# Altium schematic sheet FPGA_U1_Auto.SchDoc
size A0; Generated From FPGA Project: M2FS_FLS_Data_Formatter_8_14_2012.PrjFpg; UNUSED_SPECIAL: RouteSeparate; UNUSED_IO: NoERC; VREF: NoERC; UNUSED_INPUT: NoERC
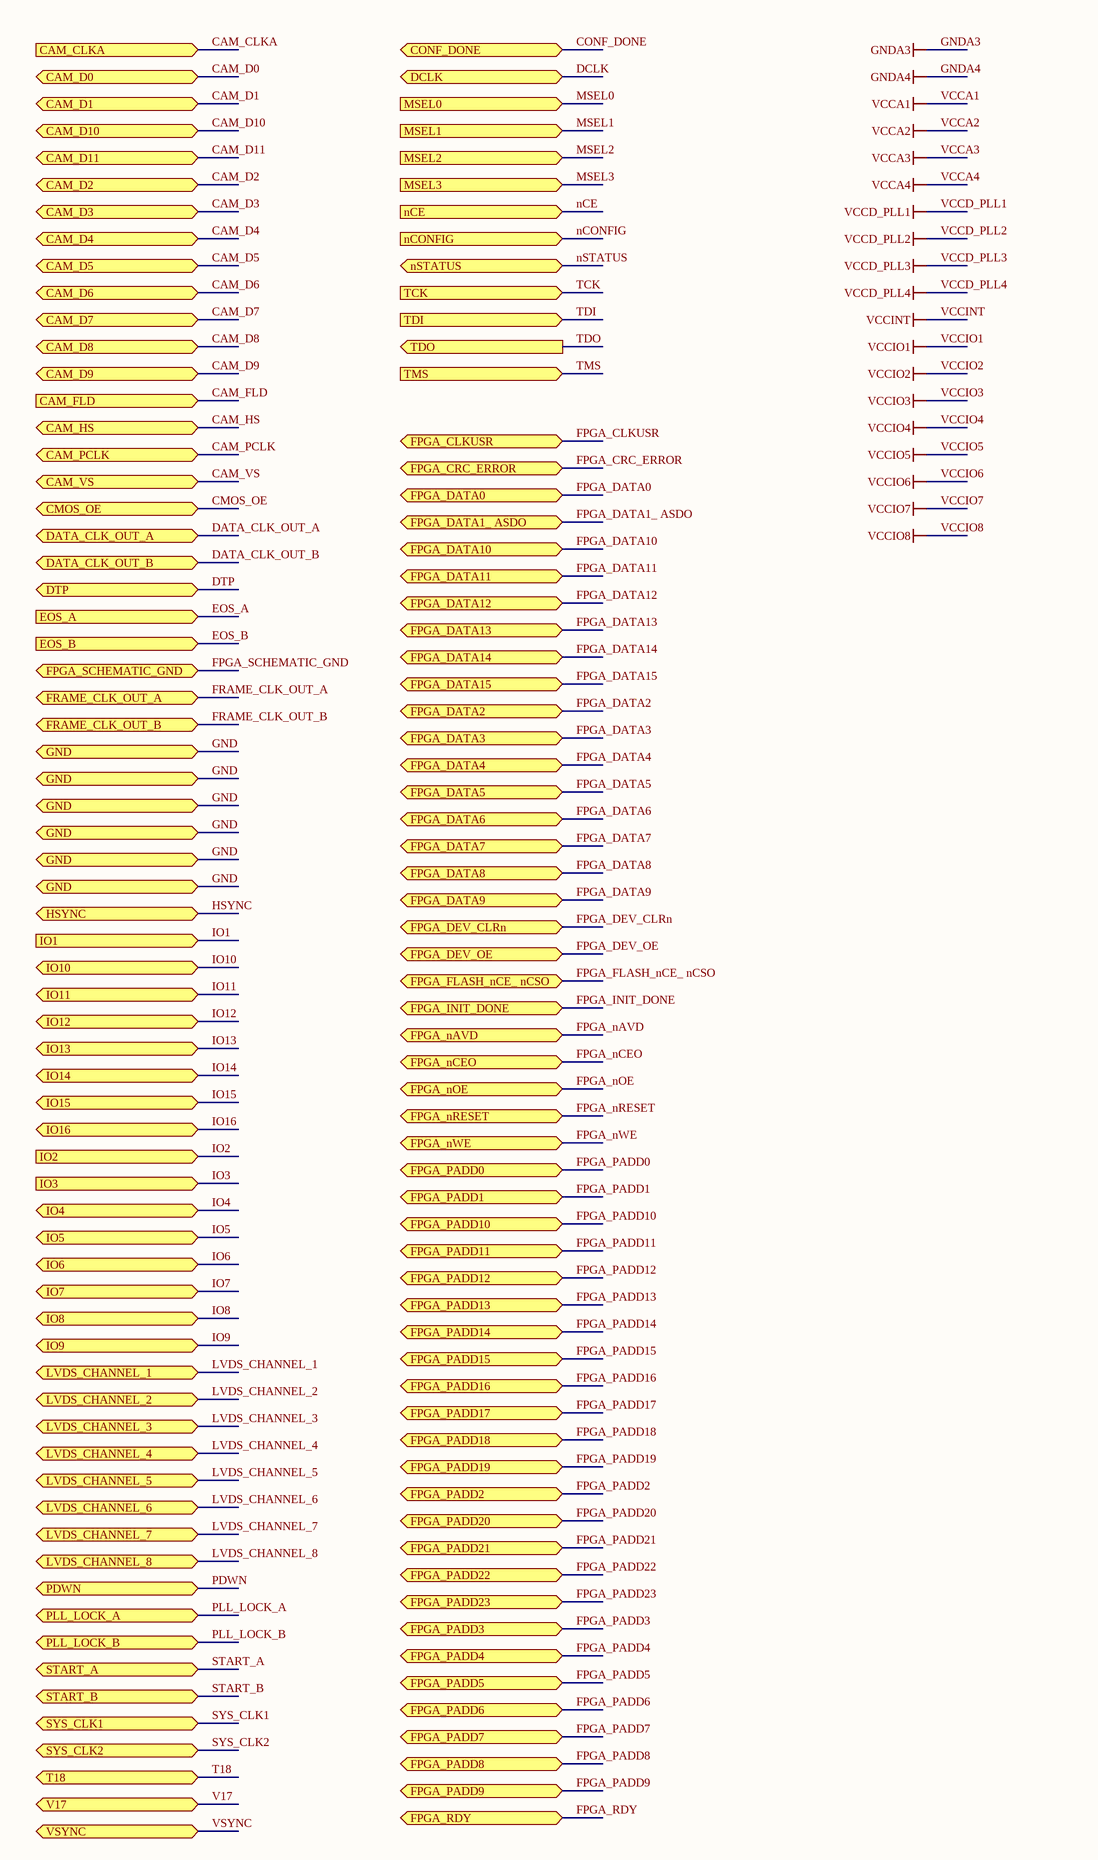
[diagram p0: FPGA_U1_Auto.SchDoc, top left]
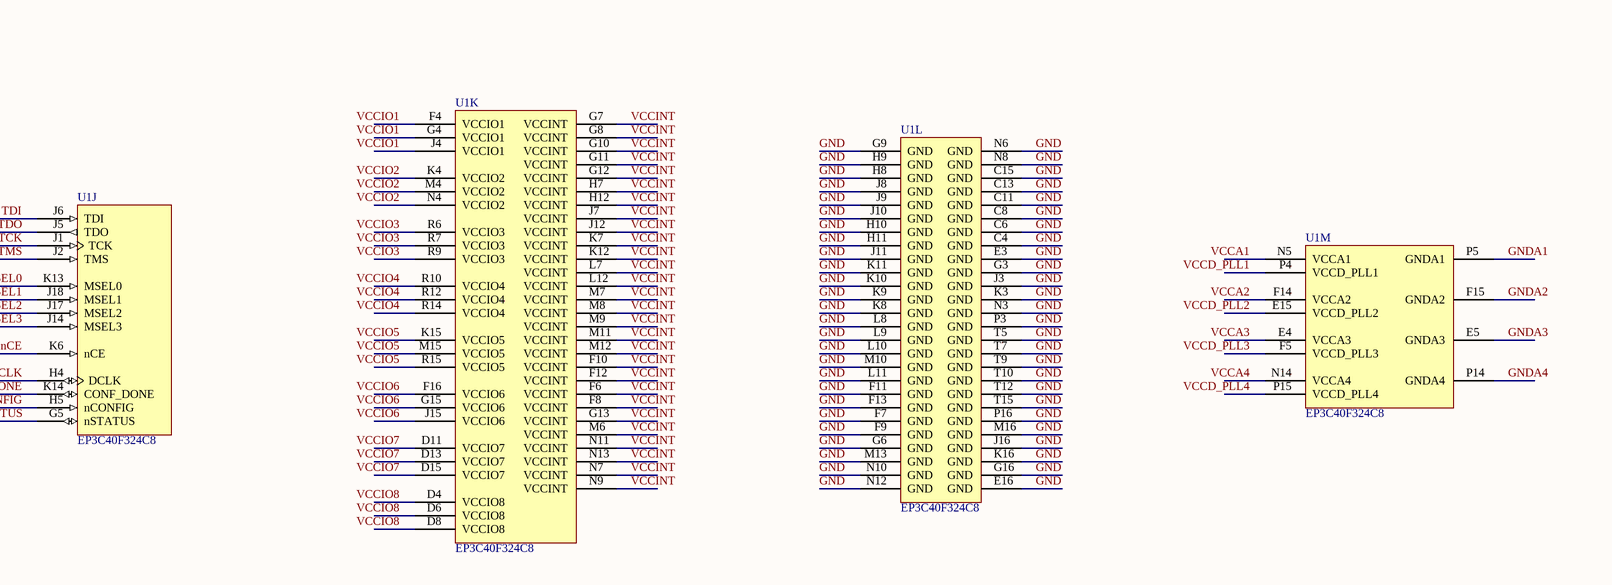
[diagram p1: FPGA_U1_Auto.SchDoc, top middle]
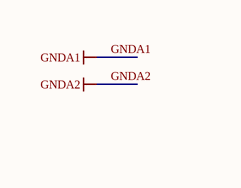
[diagram p2: FPGA_U1_Auto.SchDoc, bottom left]
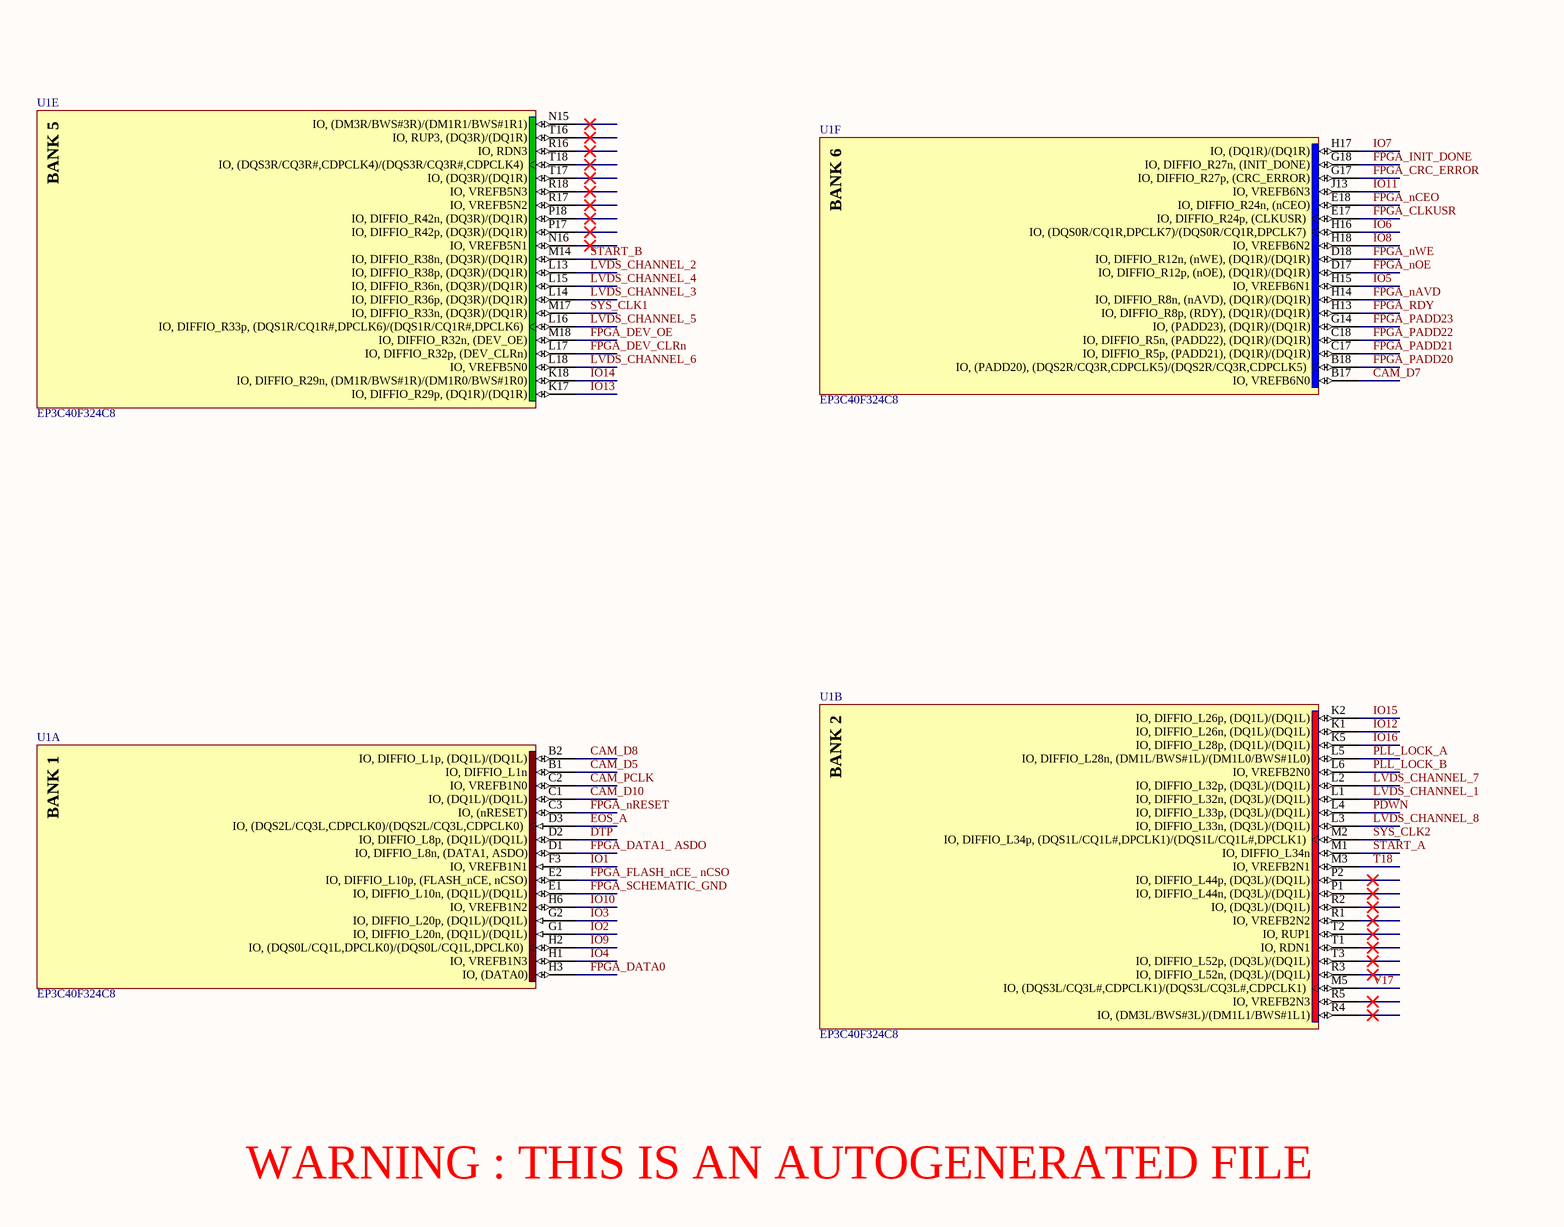
[diagram p3: FPGA_U1_Auto.SchDoc, bottom middle]
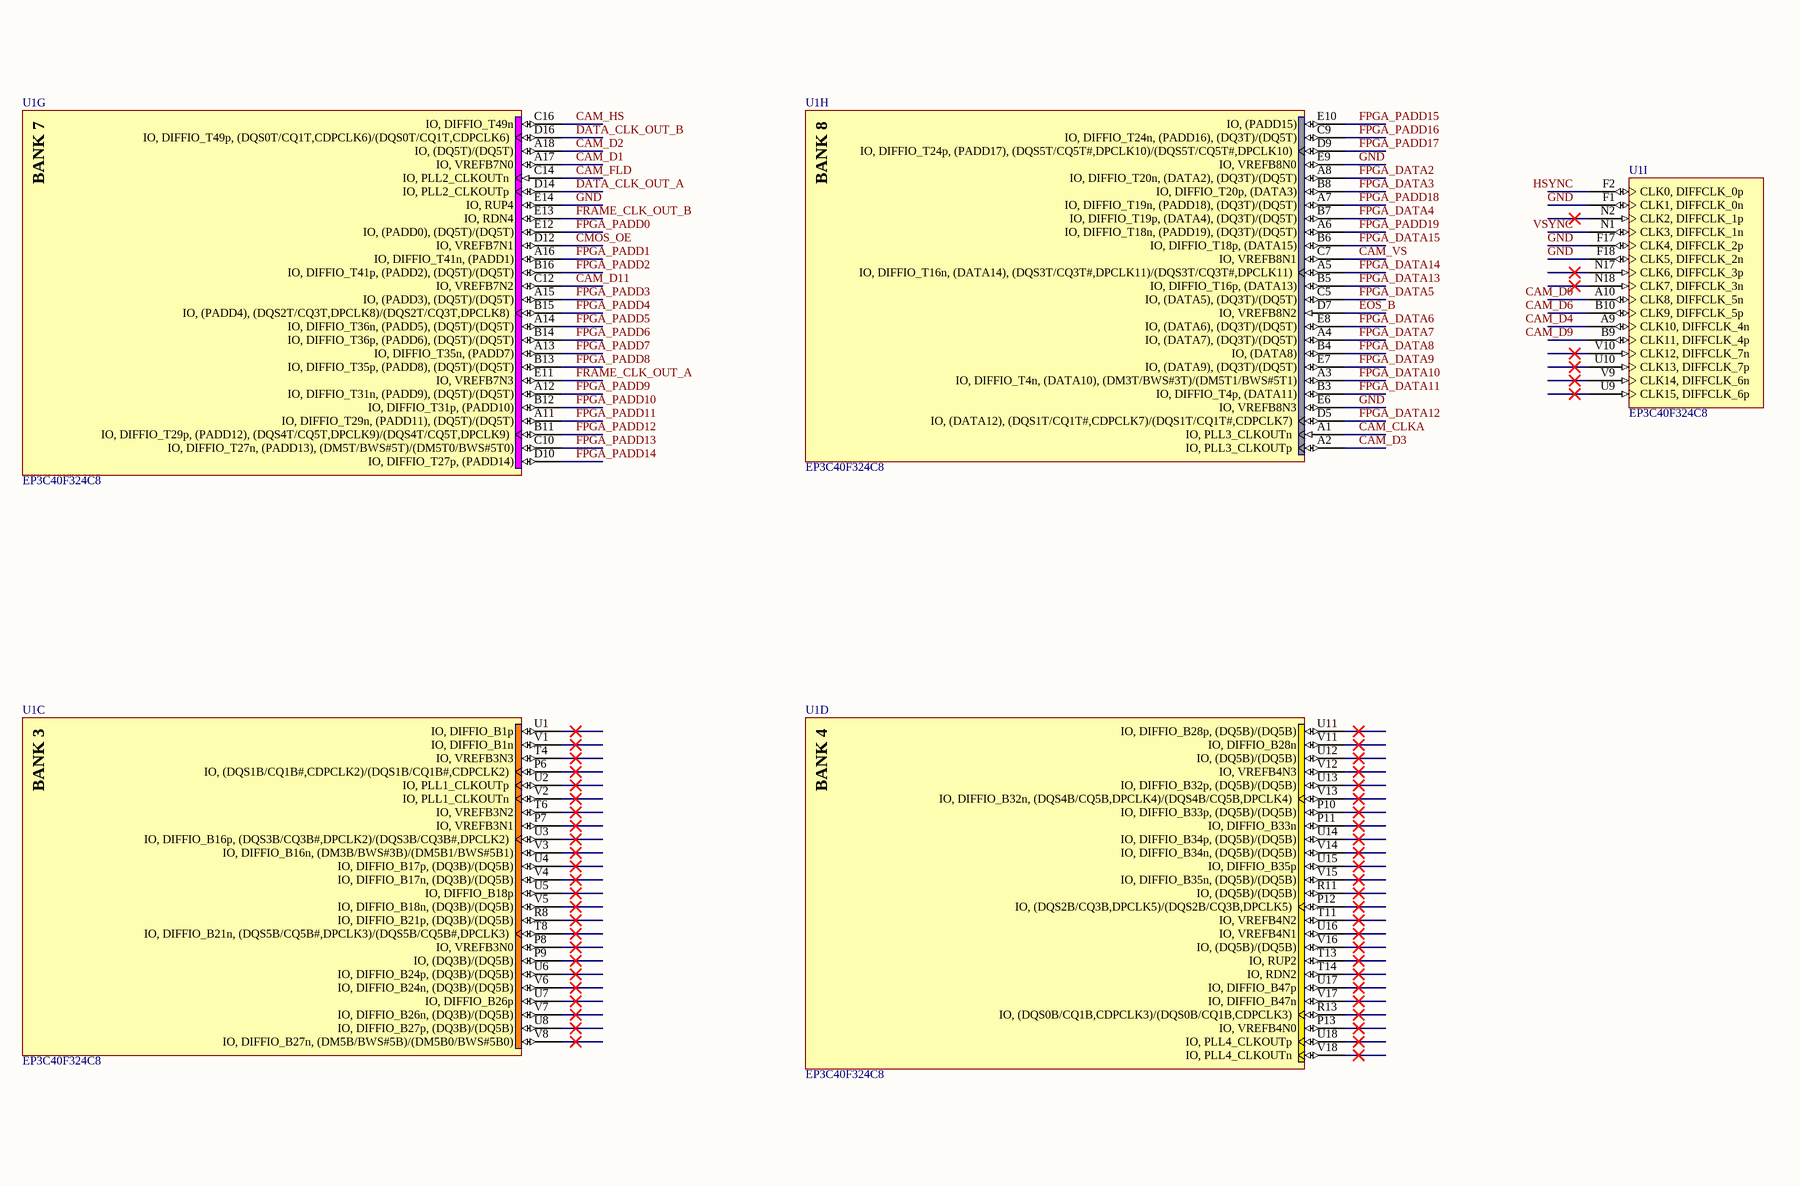
[diagram p4: FPGA_U1_Auto.SchDoc, bottom right]

## Parts
U1  EP3C40F324C8  [FBGA324]  (parts A,B,C,D,E,F,G,H,I,J,K,L,M of 13)

## Ports
CAM_CLKA (in), CAM_D0 (bidir), CAM_D1 (bidir), CAM_D2 (bidir), CAM_D3 (bidir), CAM_D4 (bidir), CAM_D5 (bidir), CAM_D6 (bidir), CAM_D7 (bidir), CAM_D8 (bidir), CAM_D9 (bidir), CAM_D10 (bidir), CAM_D11 (bidir), CAM_FLD (in), CAM_HS (bidir), CAM_PCLK (bidir), CAM_VS (bidir), CMOS_OE (bidir), CONF_DONE (bidir), DATA_CLK_OUT_A (bidir), DATA_CLK_OUT_B (bidir), DCLK (bidir), DTP (bidir), EOS_A (in), EOS_B (in), FPGA_CLKUSR (bidir), FPGA_CRC_ERROR (bidir), FPGA_DATA0 (bidir), FPGA_DATA1_ ASDO (bidir), FPGA_DATA2 (bidir), FPGA_DATA3 (bidir), FPGA_DATA4 (bidir), FPGA_DATA5 (bidir), FPGA_DATA6 (bidir), FPGA_DATA7 (bidir), FPGA_DATA8 (bidir), FPGA_DATA9 (bidir), FPGA_DATA10 (bidir), FPGA_DATA11 (bidir), FPGA_DATA12 (bidir), FPGA_DATA13 (bidir), FPGA_DATA14 (bidir), FPGA_DATA15 (bidir), FPGA_DEV_CLRn (bidir), FPGA_DEV_OE (bidir), FPGA_FLASH_nCE_ nCSO (bidir), FPGA_INIT_DONE (bidir), FPGA_nAVD (bidir), FPGA_nCEO (bidir), FPGA_nOE (bidir), FPGA_nRESET (bidir), FPGA_nWE (bidir), FPGA_PADD0 (bidir), FPGA_PADD1 (bidir), FPGA_PADD2 (bidir), FPGA_PADD3 (bidir), FPGA_PADD4 (bidir), FPGA_PADD5 (bidir), FPGA_PADD6 (bidir), FPGA_PADD7 (bidir), FPGA_PADD8 (bidir), FPGA_PADD9 (bidir), FPGA_PADD10 (bidir), FPGA_PADD11 (bidir), FPGA_PADD12 (bidir), FPGA_PADD13 (bidir), FPGA_PADD14 (bidir), FPGA_PADD15 (bidir), FPGA_PADD16 (bidir), FPGA_PADD17 (bidir), FPGA_PADD18 (bidir), FPGA_PADD19 (bidir), FPGA_PADD20 (bidir), FPGA_PADD21 (bidir), FPGA_PADD22 (bidir), FPGA_PADD23 (bidir), FPGA_RDY (bidir), FPGA_SCHEMATIC_GND (bidir), FRAME_CLK_OUT_A (bidir), FRAME_CLK_OUT_B (bidir), GND (bidir), HSYNC (bidir), IO1 (in), IO2 (in), IO3 (in), IO4 (bidir), IO5 (bidir), IO6 (bidir), IO7 (bidir), IO8 (bidir), IO9 (bidir), IO10 (bidir), IO11 (bidir), IO12 (bidir), IO13 (bidir), IO14 (bidir), IO15 (bidir), IO16 (bidir), LVDS_CHANNEL_1 (bidir), LVDS_CHANNEL_2 (bidir), LVDS_CHANNEL_3 (bidir), LVDS_CHANNEL_4 (bidir), LVDS_CHANNEL_5 (bidir), LVDS_CHANNEL_6 (bidir), LVDS_CHANNEL_7 (bidir), LVDS_CHANNEL_8 (bidir), MSEL0 (in), MSEL1 (in), MSEL2 (in), MSEL3 (in), nCE (in), nCONFIG (in), nSTATUS (bidir), PDWN (bidir), PLL_LOCK_A (bidir), PLL_LOCK_B (bidir), START_A (bidir), START_B (bidir), SYS_CLK1 (bidir), SYS_CLK2 (bidir), T18 (bidir), TCK (in), TDI (in), TDO (out), TMS (in), V17 (bidir), VSYNC (bidir)

## Nets
GNDA1: U1.P5(GNDA1)
GNDA2: U1.F15(GNDA2)
GNDA3: U1.E5(GNDA3)
GNDA4: U1.P14(GNDA4)
VCCA1: U1.N5(VCCA1)
VCCA2: U1.F14(VCCA2)
VCCA3: U1.E4(VCCA3)
VCCA4: U1.N14(VCCA4)
VCCD_PLL1: U1.P4(VCCD_PLL1)
VCCD_PLL2: U1.E15(VCCD_PLL2)
VCCD_PLL3: U1.F5(VCCD_PLL3)
VCCD_PLL4: U1.P15(VCCD_PLL4)
VCCINT: U1.F6(VCCINT) U1.F8(VCCINT) U1.F10(VCCINT) U1.F12(VCCINT) U1.G7(VCCINT) U1.G8(VCCINT) U1.G10(VCCINT) U1.G11(VCCINT) U1.G12(VCCINT) U1.G13(VCCINT) U1.H7(VCCINT) U1.H12(VCCINT) U1.J7(VCCINT) U1.J12(VCCINT) U1.K7(VCCINT) U1.K12(VCCINT) U1.L7(VCCINT) U1.L12(VCCINT) U1.M6(VCCINT) U1.M7(VCCINT) U1.M8(VCCINT) U1.M9(VCCINT) U1.M11(VCCINT) U1.M12(VCCINT) U1.N7(VCCINT) U1.N9(VCCINT) U1.N11(VCCINT) U1.N13(VCCINT)
VCCIO1: U1.F4(VCCIO1) U1.G4(VCCIO1) U1.J4(VCCIO1)
VCCIO2: U1.K4(VCCIO2) U1.M4(VCCIO2) U1.N4(VCCIO2)
VCCIO3: U1.R6(VCCIO3) U1.R7(VCCIO3) U1.R9(VCCIO3)
VCCIO4: U1.R10(VCCIO4) U1.R12(VCCIO4) U1.R14(VCCIO4)
VCCIO5: U1.K15(VCCIO5) U1.M15(VCCIO5) U1.R15(VCCIO5)
VCCIO6: U1.F16(VCCIO6) U1.G15(VCCIO6) U1.J15(VCCIO6)
VCCIO7: U1.D11(VCCIO7) U1.D13(VCCIO7) U1.D15(VCCIO7)
VCCIO8: U1.D4(VCCIO8) U1.D6(VCCIO8) U1.D8(VCCIO8)
CAM_CLKA: U1.A1(IO,_PLL3_CLKOUTn) ; port CAM_CLKA
CAM_D0: U1.A10(CLK8,_DIFFCLK_5n) ; port CAM_D0
CAM_D1: U1.A17(IO,_VREFB7N0) ; port CAM_D1
CAM_D2: U1.A18(IO,_(DQ5T)/(DQ5T)) ; port CAM_D2
CAM_D3: U1.A2(IO,_PLL3_CLKOUTp) ; port CAM_D3
CAM_D4: U1.A9(CLK10,_DIFFCLK_4n) ; port CAM_D4
CAM_D5: U1.B1(IO,_DIFFIO_L1n) ; port CAM_D5
CAM_D6: U1.B10(CLK9,_DIFFCLK_5p) ; port CAM_D6
CAM_D7: U1.B17(IO,_VREFB6N0) ; port CAM_D7
CAM_D8: U1.B2(IO,_DIFFIO_L1p,_(DQ1L)/(DQ1L)) ; port CAM_D8
CAM_D9: U1.B9(CLK11,_DIFFCLK_4p) ; port CAM_D9
CAM_D10: U1.C1(IO,_(DQ1L)/(DQ1L)) ; port CAM_D10
CAM_D11: U1.C12(IO,_VREFB7N2) ; port CAM_D11
CAM_FLD: U1.C14(IO,_PLL2_CLKOUTn) ; port CAM_FLD
CAM_HS: U1.C16(IO,_DIFFIO_T49n) ; port CAM_HS
CAM_PCLK: U1.C2(IO,_VREFB1N0) ; port CAM_PCLK
CAM_VS: U1.C7(IO,_VREFB8N1) ; port CAM_VS
CMOS_OE: U1.D12(IO,_VREFB7N1) ; port CMOS_OE
CONF_DONE: U1.K14(CONF_DONE) ; port CONF_DONE
DATA_CLK_OUT_A: U1.D14(IO,_PLL2_CLKOUTp) ; port DATA_CLK_OUT_A
DATA_CLK_OUT_B: U1.D16(IO,_DIFFIO_T49p,_(DQS0T/CQ1T,CDPCLK6)/(DQS0T/CQ1T,CDPCLK6)) ; port DATA_CLK_OUT_B
DCLK: U1.H4(DCLK) ; port DCLK
DTP: U1.D2(IO,_DIFFIO_L8p,_(DQ1L)/(DQ1L)) ; port DTP
EOS_A: U1.D3(IO,_(DQS2L/CQ3L,CDPCLK0)/(DQS2L/CQ3L,CDPCLK0)) ; port EOS_A
EOS_B: U1.D7(IO,_VREFB8N2) ; port EOS_B
FPGA_CLKUSR: U1.E17(IO,_DIFFIO_R24p,_(CLKUSR)) ; port FPGA_CLKUSR
FPGA_CRC_ERROR: U1.G17(IO,_DIFFIO_R27p,_(CRC_ERROR)) ; port FPGA_CRC_ERROR
FPGA_DATA0: U1.H3(IO,_(DATA0)) ; port FPGA_DATA0
FPGA_DATA1_ ASDO: U1.D1(IO,_DIFFIO_L8n,_(DATA1,_ASDO)) ; port FPGA_DATA1_ ASDO
FPGA_DATA2: U1.A8(IO,_DIFFIO_T20n,_(DATA2),_(DQ3T)/(DQ5T)) ; port FPGA_DATA2
FPGA_DATA3: U1.B8(IO,_DIFFIO_T20p,_(DATA3)) ; port FPGA_DATA3
FPGA_DATA4: U1.B7(IO,_DIFFIO_T19p,_(DATA4),_(DQ3T)/(DQ5T)) ; port FPGA_DATA4
FPGA_DATA5: U1.C5(IO,_(DATA5),_(DQ3T)/(DQ5T)) ; port FPGA_DATA5
FPGA_DATA6: U1.E8(IO,_(DATA6),_(DQ3T)/(DQ5T)) ; port FPGA_DATA6
FPGA_DATA7: U1.A4(IO,_(DATA7),_(DQ3T)/(DQ5T)) ; port FPGA_DATA7
FPGA_DATA8: U1.B4(IO,_(DATA8)) ; port FPGA_DATA8
FPGA_DATA9: U1.E7(IO,_(DATA9),_(DQ3T)/(DQ5T)) ; port FPGA_DATA9
FPGA_DATA10: U1.A3(IO,_DIFFIO_T4n,_(DATA10),_(DM3T/BWS#3T)/(DM5T1/BWS#5T1)) ; port FPGA_DATA10
FPGA_DATA11: U1.B3(IO,_DIFFIO_T4p,_(DATA11)) ; port FPGA_DATA11
FPGA_DATA12: U1.D5(IO,_(DATA12),_(DQS1T/CQ1T#,CDPCLK7)/(DQS1T/CQ1T#,CDPCLK7)) ; port FPGA_DATA12
FPGA_DATA13: U1.B5(IO,_DIFFIO_T16p,_(DATA13)) ; port FPGA_DATA13
FPGA_DATA14: U1.A5(IO,_DIFFIO_T16n,_(DATA14),_(DQS3T/CQ3T#,DPCLK11)/(DQS3T/CQ3T#,DPCLK11)) ; port FPGA_DATA14
FPGA_DATA15: U1.B6(IO,_DIFFIO_T18p,_(DATA15)) ; port FPGA_DATA15
FPGA_DEV_CLRn: U1.L17(IO,_DIFFIO_R32p,_(DEV_CLRn)) ; port FPGA_DEV_CLRn
FPGA_DEV_OE: U1.M18(IO,_DIFFIO_R32n,_(DEV_OE)) ; port FPGA_DEV_OE
FPGA_FLASH_nCE_ nCSO: U1.E2(IO,_DIFFIO_L10p,_(FLASH_nCE,_nCSO)) ; port FPGA_FLASH_nCE_ nCSO
FPGA_INIT_DONE: U1.G18(IO,_DIFFIO_R27n,_(INIT_DONE)) ; port FPGA_INIT_DONE
FPGA_nAVD: U1.H14(IO,_DIFFIO_R8n,_(nAVD),_(DQ1R)/(DQ1R)) ; port FPGA_nAVD
FPGA_nCEO: U1.E18(IO,_DIFFIO_R24n,_(nCEO)) ; port FPGA_nCEO
FPGA_nOE: U1.D17(IO,_DIFFIO_R12p,_(nOE),_(DQ1R)/(DQ1R)) ; port FPGA_nOE
FPGA_nRESET: U1.C3(IO,_(nRESET)) ; port FPGA_nRESET
FPGA_nWE: U1.D18(IO,_DIFFIO_R12n,_(nWE),_(DQ1R)/(DQ1R)) ; port FPGA_nWE
FPGA_PADD0: U1.E12(IO,_(PADD0),_(DQ5T)/(DQ5T)) ; port FPGA_PADD0
FPGA_PADD1: U1.A16(IO,_DIFFIO_T41n,_(PADD1)) ; port FPGA_PADD1
FPGA_PADD2: U1.B16(IO,_DIFFIO_T41p,_(PADD2),_(DQ5T)/(DQ5T)) ; port FPGA_PADD2
FPGA_PADD3: U1.A15(IO,_(PADD3),_(DQ5T)/(DQ5T)) ; port FPGA_PADD3
FPGA_PADD4: U1.B15(IO,_(PADD4),_(DQS2T/CQ3T,DPCLK8)/(DQS2T/CQ3T,DPCLK8)) ; port FPGA_PADD4
FPGA_PADD5: U1.A14(IO,_DIFFIO_T36n,_(PADD5),_(DQ5T)/(DQ5T)) ; port FPGA_PADD5
FPGA_PADD6: U1.B14(IO,_DIFFIO_T36p,_(PADD6),_(DQ5T)/(DQ5T)) ; port FPGA_PADD6
FPGA_PADD7: U1.A13(IO,_DIFFIO_T35n,_(PADD7)) ; port FPGA_PADD7
FPGA_PADD8: U1.B13(IO,_DIFFIO_T35p,_(PADD8),_(DQ5T)/(DQ5T)) ; port FPGA_PADD8
FPGA_PADD9: U1.A12(IO,_DIFFIO_T31n,_(PADD9),_(DQ5T)/(DQ5T)) ; port FPGA_PADD9
FPGA_PADD10: U1.B12(IO,_DIFFIO_T31p,_(PADD10)) ; port FPGA_PADD10
FPGA_PADD11: U1.A11(IO,_DIFFIO_T29n,_(PADD11),_(DQ5T)/(DQ5T)) ; port FPGA_PADD11
FPGA_PADD12: U1.B11(IO,_DIFFIO_T29p,_(PADD12),_(DQS4T/CQ5T,DPCLK9)/(DQS4T/CQ5T,DPCLK9)) ; port FPGA_PADD12
FPGA_PADD13: U1.C10(IO,_DIFFIO_T27n,_(PADD13),_(DM5T/BWS#5T)/(DM5T0/BWS#5T0)) ; port FPGA_PADD13
FPGA_PADD14: U1.D10(IO,_DIFFIO_T27p,_(PADD14)) ; port FPGA_PADD14
FPGA_PADD15: U1.E10(IO,_(PADD15)) ; port FPGA_PADD15
FPGA_PADD16: U1.C9(IO,_DIFFIO_T24n,_(PADD16),_(DQ3T)/(DQ5T)) ; port FPGA_PADD16
FPGA_PADD17: U1.D9(IO,_DIFFIO_T24p,_(PADD17),_(DQS5T/CQ5T#,DPCLK10)/(DQS5T/CQ5T#,DPCLK10)) ; port FPGA_PADD17
FPGA_PADD18: U1.A7(IO,_DIFFIO_T19n,_(PADD18),_(DQ3T)/(DQ5T)) ; port FPGA_PADD18
FPGA_PADD19: U1.A6(IO,_DIFFIO_T18n,_(PADD19),_(DQ3T)/(DQ5T)) ; port FPGA_PADD19
FPGA_PADD20: U1.B18(IO,_(PADD20),_(DQS2R/CQ3R,CDPCLK5)/(DQS2R/CQ3R,CDPCLK5)) ; port FPGA_PADD20
FPGA_PADD21: U1.C17(IO,_DIFFIO_R5p,_(PADD21),_(DQ1R)/(DQ1R)) ; port FPGA_PADD21
FPGA_PADD22: U1.C18(IO,_DIFFIO_R5n,_(PADD22),_(DQ1R)/(DQ1R)) ; port FPGA_PADD22
FPGA_PADD23: U1.G14(IO,_(PADD23),_(DQ1R)/(DQ1R)) ; port FPGA_PADD23
FPGA_RDY: U1.H13(IO,_DIFFIO_R8p,_(RDY),_(DQ1R)/(DQ1R)) ; port FPGA_RDY
FPGA_SCHEMATIC_GND: U1.E1(IO,_DIFFIO_L10n,_(DQ1L)/(DQ1L)) ; port FPGA_SCHEMATIC_GND
FRAME_CLK_OUT_A: U1.E11(IO,_VREFB7N3) ; port FRAME_CLK_OUT_A
FRAME_CLK_OUT_B: U1.E13(IO,_RDN4) ; port FRAME_CLK_OUT_B
GND: U1.C4(GND) U1.C6(GND) U1.C8(GND) U1.C11(GND) U1.C13(GND) U1.C15(GND) U1.E3(GND) U1.E6(IO,_VREFB8N3) U1.E9(IO,_VREFB8N0) U1.E14(IO,_RUP4) U1.E16(GND) U1.F1(CLK1,_DIFFCLK_0n) U1.F7(GND) U1.F9(GND) U1.F11(GND) U1.F13(GND) U1.F17(CLK4,_DIFFCLK_2p) U1.F18(CLK5,_DIFFCLK_2n) U1.G3(GND) U1.G6(GND) U1.G9(GND) U1.G16(GND) U1.H8(GND) U1.H9(GND) U1.H10(GND) U1.H11(GND) U1.J3(GND) U1.J8(GND) U1.J9(GND) U1.J10(GND) U1.J11(GND) U1.J16(GND) U1.K3(GND) U1.K8(GND) U1.K9(GND) U1.K10(GND) U1.K11(GND) U1.K16(GND) U1.L8(GND) U1.L9(GND) U1.L10(GND) U1.L11(GND) U1.M10(GND) U1.M13(GND) U1.M16(GND) U1.N3(GND) U1.N6(GND) U1.N8(GND) U1.N10(GND) U1.N12(GND) U1.P3(GND) U1.P16(GND) U1.T5(GND) U1.T7(GND) U1.T9(GND) U1.T10(GND) U1.T12(GND) U1.T15(GND) ; port GND
HSYNC: U1.F2(CLK0,_DIFFCLK_0p) ; port HSYNC
IO1: U1.F3(IO,_VREFB1N1) ; port IO1
IO2: U1.G1(IO,_DIFFIO_L20n,_(DQ1L)/(DQ1L)) ; port IO2
IO3: U1.G2(IO,_DIFFIO_L20p,_(DQ1L)/(DQ1L)) ; port IO3
IO4: U1.H1(IO,_VREFB1N3) ; port IO4
IO5: U1.H15(IO,_VREFB6N1) ; port IO5
IO6: U1.H16(IO,_(DQS0R/CQ1R,DPCLK7)/(DQS0R/CQ1R,DPCLK7)) ; port IO6
IO7: U1.H17(IO,_(DQ1R)/(DQ1R)) ; port IO7
IO8: U1.H18(IO,_VREFB6N2) ; port IO8
IO9: U1.H2(IO,_(DQS0L/CQ1L,DPCLK0)/(DQS0L/CQ1L,DPCLK0)) ; port IO9
IO10: U1.H6(IO,_VREFB1N2) ; port IO10
IO11: U1.J13(IO,_VREFB6N3) ; port IO11
IO12: U1.K1(IO,_DIFFIO_L26n,_(DQ1L)/(DQ1L)) ; port IO12
IO13: U1.K17(IO,_DIFFIO_R29p,_(DQ1R)/(DQ1R)) ; port IO13
IO14: U1.K18(IO,_DIFFIO_R29n,_(DM1R/BWS#1R)/(DM1R0/BWS#1R0)) ; port IO14
IO15: U1.K2(IO,_DIFFIO_L26p,_(DQ1L)/(DQ1L)) ; port IO15
IO16: U1.K5(IO,_DIFFIO_L28p,_(DQ1L)/(DQ1L)) ; port IO16
LVDS_CHANNEL_1: U1.L1(IO,_DIFFIO_L32n,_(DQ3L)/(DQ1L)) ; port LVDS_CHANNEL_1
LVDS_CHANNEL_2: U1.L13(IO,_DIFFIO_R38p,_(DQ3R)/(DQ1R)) ; port LVDS_CHANNEL_2
LVDS_CHANNEL_3: U1.L14(IO,_DIFFIO_R36p,_(DQ3R)/(DQ1R)) ; port LVDS_CHANNEL_3
LVDS_CHANNEL_4: U1.L15(IO,_DIFFIO_R36n,_(DQ3R)/(DQ1R)) ; port LVDS_CHANNEL_4
LVDS_CHANNEL_5: U1.L16(IO,_DIFFIO_R33p,_(DQS1R/CQ1R#,DPCLK6)/(DQS1R/CQ1R#,DPCLK6)) ; port LVDS_CHANNEL_5
LVDS_CHANNEL_6: U1.L18(IO,_VREFB5N0) ; port LVDS_CHANNEL_6
LVDS_CHANNEL_7: U1.L2(IO,_DIFFIO_L32p,_(DQ3L)/(DQ1L)) ; port LVDS_CHANNEL_7
LVDS_CHANNEL_8: U1.L3(IO,_DIFFIO_L33n,_(DQ3L)/(DQ1L)) ; port LVDS_CHANNEL_8
MSEL0: U1.K13(MSEL0) ; port MSEL0
MSEL1: U1.J18(MSEL1) ; port MSEL1
MSEL2: U1.J17(MSEL2) ; port MSEL2
MSEL3: U1.J14(MSEL3) ; port MSEL3
nCE: U1.K6(nCE) ; port nCE
nCONFIG: U1.H5(nCONFIG) ; port nCONFIG
nSTATUS: U1.G5(nSTATUS) ; port nSTATUS
PDWN: U1.L4(IO,_DIFFIO_L33p,_(DQ3L)/(DQ1L)) ; port PDWN
PLL_LOCK_A: U1.L5(IO,_DIFFIO_L28n,_(DM1L/BWS#1L)/(DM1L0/BWS#1L0)) ; port PLL_LOCK_A
PLL_LOCK_B: U1.L6(IO,_VREFB2N0) ; port PLL_LOCK_B
START_A: U1.M1(IO,_DIFFIO_L34n) ; port START_A
START_B: U1.M14(IO,_DIFFIO_R38n,_(DQ3R)/(DQ1R)) ; port START_B
SYS_CLK1: U1.M17(IO,_DIFFIO_R33n,_(DQ3R)/(DQ1R)) ; port SYS_CLK1
SYS_CLK2: U1.M2(IO,_DIFFIO_L34p,_(DQS1L/CQ1L#,DPCLK1)/(DQS1L/CQ1L#,DPCLK1)) ; port SYS_CLK2
T18: U1.M3(IO,_VREFB2N1) ; port T18
TCK: U1.J1(TCK) ; port TCK
TDI: U1.J6(TDI) ; port TDI
TDO: U1.J5(TDO) ; port TDO
TMS: U1.J2(TMS) ; port TMS
V17: U1.M5(IO,_(DQS3L/CQ3L#,CDPCLK1)/(DQS3L/CQ3L#,CDPCLK1)) ; port V17
VSYNC: U1.N1(CLK3,_DIFFCLK_1n) ; port VSYNC

Not connected (* = marked no-connect by the designer): U1 N2(CLK2,_DIFFCLK_1p)* N15(IO,_(DM3R/BWS#3R)/(DM1R1/BWS#1R1))* N16(IO,_VREFB5N1)* N17(CLK6,_DIFFCLK_3p)* N18(CLK7,_DIFFCLK_3n)* P1(IO,_DIFFIO_L44n,_(DQ3L)/(DQ1L))* P2(IO,_DIFFIO_L44p,_(DQ3L)/(DQ1L))* P6(IO,_(DQS1B/CQ1B#,CDPCLK2)/(DQS1B/CQ1B#,CDPCLK2))* P7(IO,_VREFB3N1)* P8(IO,_VREFB3N0)* P9(IO,_(DQ3B)/(DQ5B))* P10(IO,_DIFFIO_B33p,_(DQ5B)/(DQ5B))* P11(IO,_DIFFIO_B33n)* P12(IO,_(DQS2B/CQ3B,DPCLK5)/(DQS2B/CQ3B,DPCLK5))* P13(IO,_VREFB4N0)* P17(IO,_DIFFIO_R42p,_(DQ3R)/(DQ1R))* P18(IO,_DIFFIO_R42n,_(DQ3R)/(DQ1R))* R1(IO,_VREFB2N2)* R2(IO,_(DQ3L)/(DQ1L))* R3(IO,_DIFFIO_L52n,_(DQ3L)/(DQ1L))* R4(IO,_(DM3L/BWS#3L)/(DM1L1/BWS#1L1))* R5(IO,_VREFB2N3)* R8(IO,_DIFFIO_B21p,_(DQ3B)/(DQ5B))* R11(IO,_(DQ5B)/(DQ5B))* R13(IO,_(DQS0B/CQ1B,CDPCLK3)/(DQS0B/CQ1B,CDPCLK3))* R16(IO,_RDN3)* R17(IO,_VREFB5N2)* R18(IO,_VREFB5N3)* T1(IO,_RDN1)* T2(IO,_RUP1)* T3(IO,_DIFFIO_L52p,_(DQ3L)/(DQ1L))* T4(IO,_VREFB3N3)* T6(IO,_VREFB3N2)* T8(IO,_DIFFIO_B21n,_(DQS5B/CQ5B#,DPCLK3)/(DQS5B/CQ5B#,DPCLK3))* T11(IO,_VREFB4N2)* T13(IO,_RUP2)* T14(IO,_RDN2)* T16(IO,_RUP3,_(DQ3R)/(DQ1R))* T17(IO,_(DQ3R)/(DQ1R))* T18(IO,_(DQS3R/CQ3R#,CDPCLK4)/(DQS3R/CQ3R#,CDPCLK4))* U1(IO,_DIFFIO_B1p)* U2(IO,_PLL1_CLKOUTp)* U3(IO,_DIFFIO_B16p,_(DQS3B/CQ3B#,DPCLK2)/(DQS3B/CQ3B#,DPCLK2))* U4(IO,_DIFFIO_B17p,_(DQ3B)/(DQ5B))* U5(IO,_DIFFIO_B18p)* U6(IO,_DIFFIO_B24p,_(DQ3B)/(DQ5B))* U7(IO,_DIFFIO_B26p)* U8(IO,_DIFFIO_B27p,_(DQ3B)/(DQ5B))* U9(CLK15,_DIFFCLK_6p)* U10(CLK13,_DIFFCLK_7p)* U11(IO,_DIFFIO_B28p,_(DQ5B)/(DQ5B))* U12(IO,_(DQ5B)/(DQ5B))* U13(IO,_DIFFIO_B32p,_(DQ5B)/(DQ5B))* U14(IO,_DIFFIO_B34p,_(DQ5B)/(DQ5B))* U15(IO,_DIFFIO_B35p)* U16(IO,_VREFB4N1)* U17(IO,_DIFFIO_B47p)* U18(IO,_PLL4_CLKOUTp)* V1(IO,_DIFFIO_B1n)* V2(IO,_PLL1_CLKOUTn)* V3(IO,_DIFFIO_B16n,_(DM3B/BWS#3B)/(DM5B1/BWS#5B1))* V4(IO,_DIFFIO_B17n,_(DQ3B)/(DQ5B))* V5(IO,_DIFFIO_B18n,_(DQ3B)/(DQ5B))* V6(IO,_DIFFIO_B24n,_(DQ3B)/(DQ5B))* V7(IO,_DIFFIO_B26n,_(DQ3B)/(DQ5B))* V8(IO,_DIFFIO_B27n,_(DM5B/BWS#5B)/(DM5B0/BWS#5B0))* V9(CLK14,_DIFFCLK_6n)* V10(CLK12,_DIFFCLK_7n)* V11(IO,_DIFFIO_B28n)* V12(IO,_VREFB4N3)* V13(IO,_DIFFIO_B32n,_(DQS4B/CQ5B,DPCLK4)/(DQS4B/CQ5B,DPCLK4))* V14(IO,_DIFFIO_B34n,_(DQ5B)/(DQ5B))* V15(IO,_DIFFIO_B35n,_(DQ5B)/(DQ5B))* V16(IO,_(DQ5B)/(DQ5B))* V17(IO,_DIFFIO_B47n)* V18(IO,_PLL4_CLKOUTn)*

## Notes on the sheet
- WARNING : THIS IS AN AUTOGENERATED FILE
- (in symbol EP3C40F324C8, part A) BANK 1
- (in symbol EP3C40F324C8, part B) BANK 2
- (in symbol EP3C40F324C8, part C) BANK 3
- (in symbol EP3C40F324C8, part D) BANK 4
- (in symbol EP3C40F324C8, part E) BANK 5
- (in symbol EP3C40F324C8, part F) BANK 6
- (in symbol EP3C40F324C8, part G) BANK 7
- (in symbol EP3C40F324C8, part H) BANK 8

## Library data of the parts
U1 = EP3C40F324C8: Cyclone III Family FPGA, 195 I/O Pins, 4 PLLs, 324-Pin FBGA, Speed Grade 8, Commercial Grade; Published: 26-Feb-2007; DatasheetVersion: ver2.0, May-2008; PackageVersion: ver16.0, Dec-2009; PackageReference: FBGA324; Publisher: Altium Limited; PackageDescription: 324-Ball FineLine Ball Grid Array (FBGA324) - Wire Bond; Supplier 1: Digi-Key; Supplier Part Number 1: 544-2483-ND; Code_JEDEC: MS-034-AAG-1; Code_IPC: BGA100P18X18-324; ComponentLink1Description: Manufacturer Link; ComponentLink1URL: http://www.altera.com/; ComponentLink2Description: Handbook (7.86MB); ComponentLink2URL: http://www.altera.com/literature/hb/cyc3/cyclone3_handbook.pdf; ComponentLink3Description: Packaging Specification; ComponentLink3URL: http://www.altera.com/literature/ds/dspkg.pdf